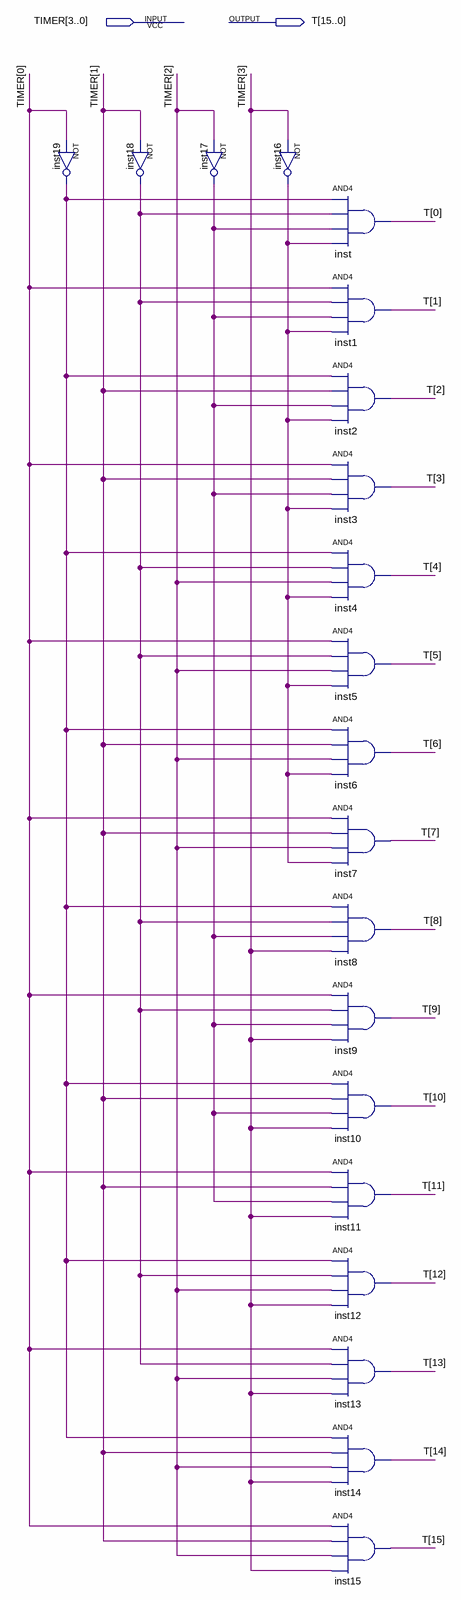
[diagram p0: schematic sheet]
// Quartus schematic TIMER_DECODER.bdf as structural Verilog: 20 symbols, 2 pins
module TIMER_DECODER (
  input  [3:0] TIMER,
  output [15:0] T
);

  wire inst16_out, inst17_out, inst18_out, inst19_out;

  not inst19 (inst19_out, TIMER[0]);
  not inst18 (inst18_out, TIMER[1]);
  not inst17 (inst17_out, TIMER[2]);
  not inst16 (inst16_out, TIMER[3]);
  and inst (T[0], inst19_out, inst18_out, inst17_out, inst16_out);
  and inst1 (T[1], TIMER[0], inst18_out, inst17_out, inst16_out);
  and inst2 (T[2], inst19_out, TIMER[1], inst17_out, inst16_out);
  and inst3 (T[3], TIMER[0], TIMER[1], inst17_out, inst16_out);
  and inst4 (T[4], inst19_out, inst18_out, TIMER[2], inst16_out);
  and inst5 (T[5], TIMER[0], inst18_out, TIMER[2], inst16_out);
  and inst6 (T[6], inst19_out, TIMER[1], TIMER[2], inst16_out);
  and inst7 (T[7], TIMER[0], TIMER[1], TIMER[2], inst16_out);
  and inst8 (T[8], inst19_out, inst18_out, inst17_out, TIMER[3]);
  and inst9 (T[9], TIMER[0], inst18_out, inst17_out, TIMER[3]);
  and inst10 (T[10], inst19_out, TIMER[1], inst17_out, TIMER[3]);
  and inst11 (T[11], TIMER[0], TIMER[1], inst17_out, TIMER[3]);
  and inst12 (T[12], inst19_out, inst18_out, TIMER[2], TIMER[3]);
  and inst13 (T[13], TIMER[0], inst18_out, TIMER[2], TIMER[3]);
  and inst14 (T[14], inst19_out, TIMER[1], TIMER[2], TIMER[3]);
  and inst15 (T[15], TIMER[0], TIMER[1], TIMER[2], TIMER[3]);
endmodule
